# EAGLE design CAN_controller_rear_lighting (EAGLE 9.6.2)
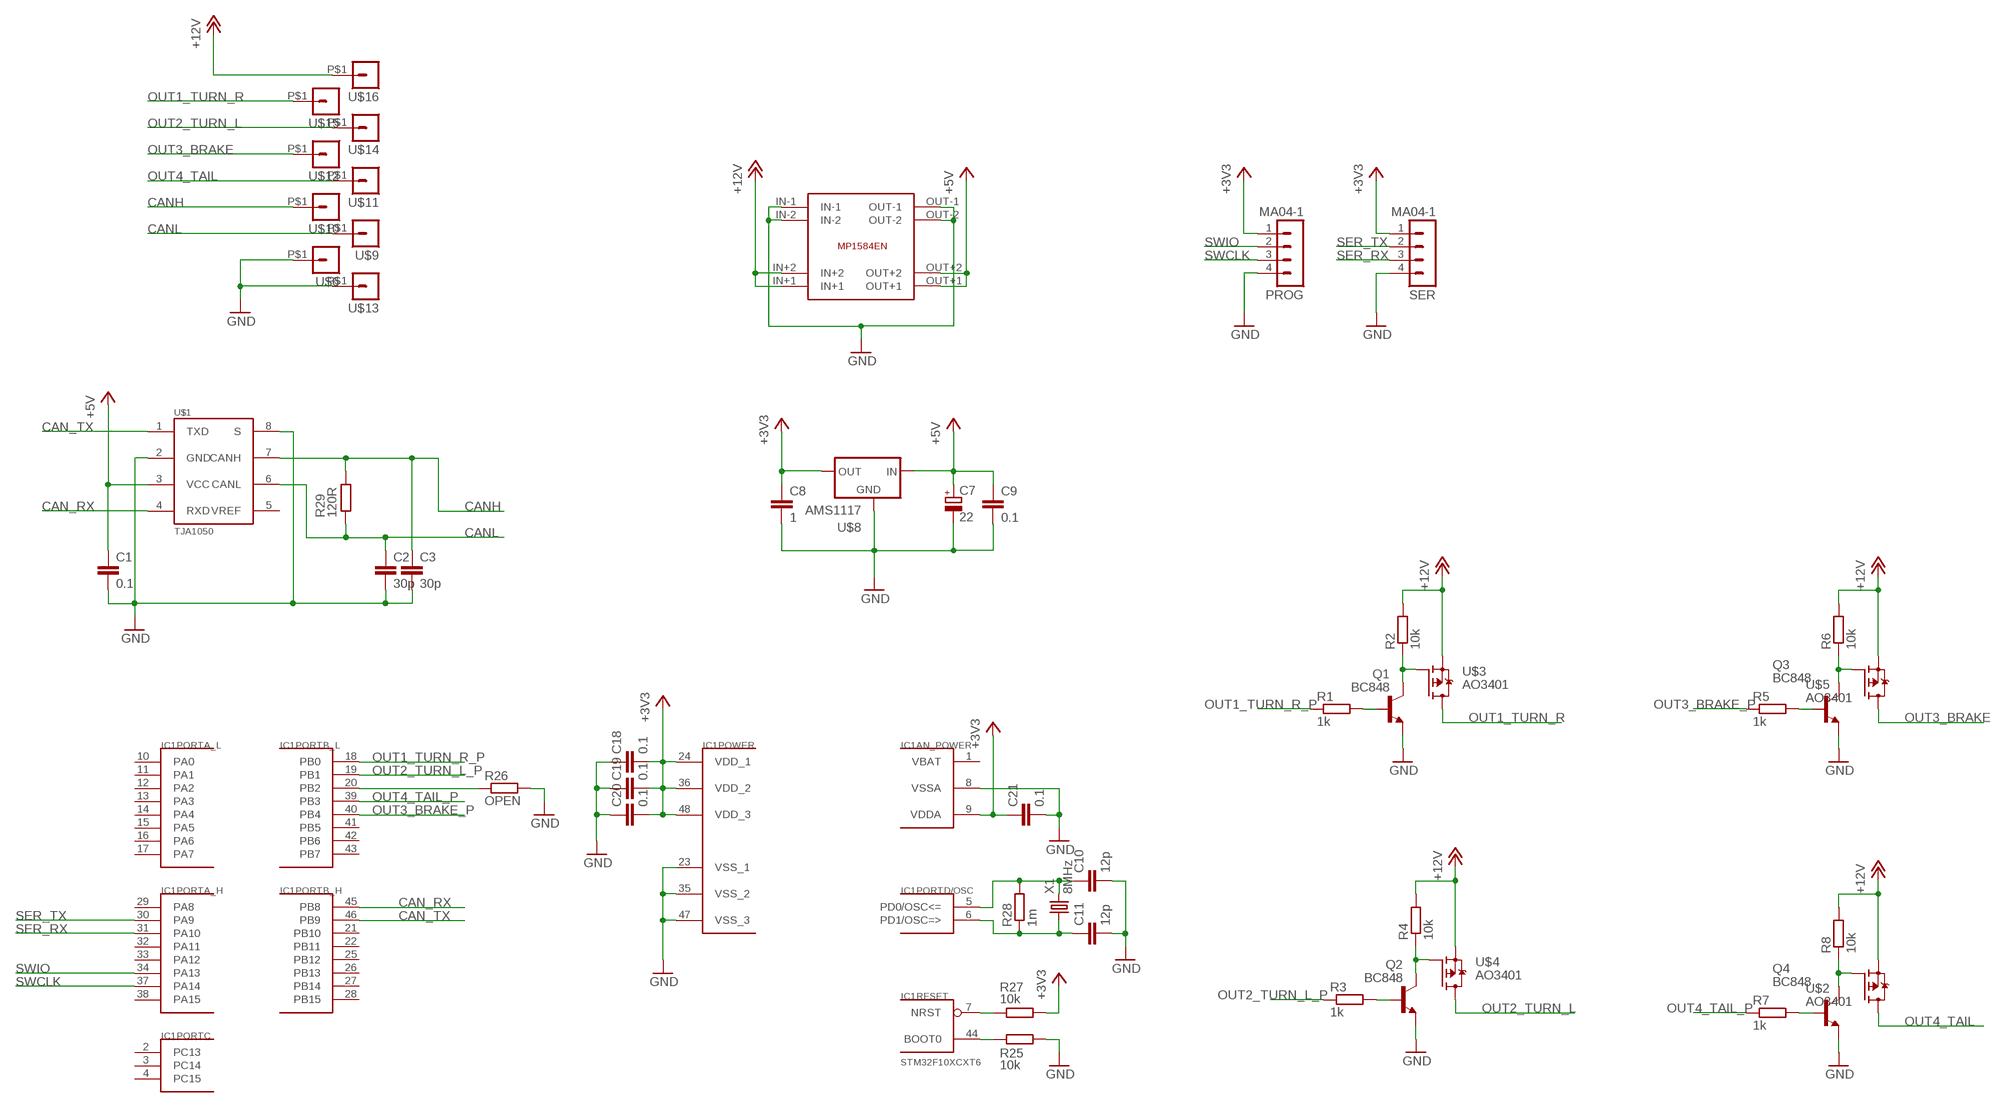
[diagram p0: schematic, sheet 1]

## Parts
C1  0.1  C-EUC0603  [C0603]
C2  30p  C-EUC0603  [C0603]
C3  30p  C-EUC0603  [C0603]
C7  22  CPOL-EUA/3216-18R  [A/3216-18R]
C8  1  C-EUC0805  [C0805]
C9  0.1  C-EUC0603  [C0603]
C10  12p  C-EUC0603  [C0603]
C11  12p  C-EUC0603  [C0603]
C18  0.1  C-EUC0603  [C0603]
C19  0.1  C-EUC0603  [C0603]
C20  0.1  C-EUC0603  [C0603]
C21  0.1  C-EUC0603  [C0603]
IC1  STM32F10XCXT6  [TQFP48]
PROG  MA04-1  [1X04]
Q1  BC848  BC848ALT1SMD  [SOT23]
Q2  BC848  BC848ALT1SMD  [SOT23]
Q3  BC848  BC848ALT1SMD  [SOT23]
Q4  BC848  BC848ALT1SMD  [SOT23]
R1  1k  R-EU_R0603  [R0603]
R2  10k  R-EU_R0603  [R0603]
R3  1k  R-EU_R0603  [R0603]
R4  10k  R-EU_R0603  [R0603]
R5  1k  R-EU_R0603  [R0603]
R6  10k  R-EU_R0603  [R0603]
R7  1k  R-EU_R0603  [R0603]
R8  10k  R-EU_R0603  [R0603]
R25  10k  R-EU_R0603  [R0603]
R26  OPEN  R-EU_R0603  [R0603]
R27  10k  R-EU_R0603  [R0603]
R28  1m  R-EU_R0603  [R0603]
R29  120R  R-EU_R0603  [R0603]
SER  MA04-1  [1X04]
U$1  TJA1050  [SO08]
U$2  AO3401  [SOT23]
U$3  AO3401  [SOT23]
U$4  AO3401  [SOT23]
U$5  AO3401  [SOT23]
U$6  MA01-1WIRE_PAD_1.5MM  [WIRE_PAD_1.5MM]
U$7  MP1584_DC-DC_MODULEMINI_22X17  [MP1584_DC-DC_MODULE]
U$8  AMS1117  [SOT223-W]
U$9  MA01-1WIRE_PAD_1.5MM  [WIRE_PAD_1.5MM]
U$10  MA01-1WIRE_PAD_1.5MM  [WIRE_PAD_1.5MM]
U$11  MA01-1WIRE_PAD_1.5MM  [WIRE_PAD_1.5MM]
U$12  MA01-1WIRE_PAD_1.5MM  [WIRE_PAD_1.5MM]
U$13  MA01-1WIRE_PAD_1.5MM  [WIRE_PAD_1.5MM]
U$14  MA01-1WIRE_PAD_1.5MM  [WIRE_PAD_1.5MM]
U$15  MA01-1WIRE_PAD_1.5MM  [WIRE_PAD_1.5MM]
U$16  MA01-1WIRE_PAD_1.5MM  [WIRE_PAD_1.5MM]
X1  8MHz  CRYSTAL  [XTAL-ECX-53]

## Nets
+3V3: C8.1 C18.2 C19.2 C20.2 C21.1 IC1.9(AN_POWER:VDDA) IC1.24(POWER:VDD_1) IC1.36(POWER:VDD_2) IC1.48(POWER:VDD_3) PROG.1 R27.2 SER.1 U$8.2(OUT)
+5V: C1.1 C7.+ C9.1 U$1.3(VCC) U$7.OUT+1 U$7.OUT+2 U$8.3(IN)
+12V: R2.2 R4.2 R6.2 R8.2 U$2.2(S) U$3.2(S) U$4.2(S) U$5.2(S) U$7.IN+1 U$7.IN+2 U$16.P$1
CAN_RX: IC1.45(PORTB_H:PB8) U$1.4(RXD)
CAN_TX: IC1.46(PORTB_H:PB9) U$1.1(TXD)
CANH: C3.1 R29.2 U$1.7(CANH) U$10.P$1
CANL: C2.1 R29.1 U$1.6(CANL) U$9.P$1
GND: C1.2 C2.2 C3.2 C7.- C8.2 C9.2 C10.2 C11.2 C18.1 C19.1 C20.1 C21.2 IC1.8(AN_POWER:VSSA) IC1.23(POWER:VSS_1) IC1.35(POWER:VSS_2) IC1.47(POWER:VSS_3) PROG.4 Q1.2(E) Q2.2(E) Q3.2(E) Q4.2(E) R25.2 R26.2 SER.4 U$1.2(GND) U$1.8(S) U$6.P$1 U$7.IN-1 U$7.IN-2 U$7.OUT-1 U$7.OUT-2 U$8.1(GND) U$13.P$1
N$1: Q2.1(B) R3.2
N$2: Q2.3(C) R4.1 U$4.1(G)
N$5: Q3.1(B) R5.2
N$6: Q1.1(B) R1.2
N$7: Q1.3(C) R2.1 U$3.1(G)
N$8: Q3.3(C) R6.1 U$5.1(G)
N$9: Q4.1(B) R7.2
N$10: Q4.3(C) R8.1 U$2.1(G)
N$11: C10.1 IC1.5(PORTD/OSC:PD0/OSC<=) R28.2 X1.2
N$12: C11.1 IC1.6(PORTD/OSC:PD1/OSC=>) R28.1 X1.1
N$14: IC1.44(RESET:BOOT0) R25.1
N$16: IC1.20(PORTB_L:PB2) R26.1
N$18: IC1.7(RESET:NRST) R27.1
OUT1_TURN_R: U$3.3(D) U$15.P$1
OUT1_TURN_R_P: IC1.18(PORTB_L:PB0) R1.1
OUT2_TURN_L: U$4.3(D) U$14.P$1
OUT2_TURN_L_P: IC1.19(PORTB_L:PB1) R3.1
OUT3_BRAKE: U$5.3(D) U$12.P$1
OUT3_BRAKE_P: IC1.40(PORTB_L:PB4) R5.1
OUT4_TAIL: U$2.3(D) U$11.P$1
OUT4_TAIL_P: IC1.39(PORTB_L:PB3) R7.1
SER_RX: IC1.31(PORTA_H:PA10) SER.3
SER_TX: IC1.30(PORTA_H:PA9) SER.2
SWCLK: IC1.37(PORTA_H:PA14) PROG.3
SWIO: IC1.34(PORTA_H:PA13) PROG.2
Unconnected: IC1.2(PORTC:PC13) IC1.3(PORTC:PC14) IC1.4(PORTC:PC15) IC1.10(PORTA_L:PA0) IC1.11(PORTA_L:PA1) IC1.12(PORTA_L:PA2) IC1.13(PORTA_L:PA3) IC1.14(PORTA_L:PA4) IC1.15(PORTA_L:PA5) IC1.16(PORTA_L:PA6) IC1.17(PORTA_L:PA7) IC1.21(PORTB_H:PB10) IC1.22(PORTB_H:PB11) IC1.25(PORTB_H:PB12) IC1.26(PORTB_H:PB13) IC1.27(PORTB_H:PB14) IC1.28(PORTB_H:PB15) IC1.29(PORTA_H:PA8) IC1.32(PORTA_H:PA11) IC1.33(PORTA_H:PA12) IC1.38(PORTA_H:PA15) IC1.41(PORTB_L:PB5) IC1.42(PORTB_L:PB6) IC1.43(PORTB_L:PB7) U$1.5(VREF)

## Power pins joined to a net without a drawn wire
VBAT: IC1.1(AN_POWER:VBAT)

## Library data of the parts
C1-C3 C8-C11 C18-C21 = rcl:C-EU: CAPACITOR, European symbol; SPICEPREFIX: C
C7 = rcl:CPOL-EU: POLARIZED CAPACITOR, European symbol; SPICEPREFIX: C
IC1 = stm32:STM32F10XCXT6: ST STM32F101/103 48pin LQFP
PROG SER = motorcycle_projects:MA04-1
Q1-Q4 = common_components:BC848*: NPN Transistor
R1-R8 R25-R29 = resistor:R-EU_: RESISTOR, European symbol
U$1 = motorcycle_projects_copy:TJA1050
U$2-U$5 = common_components:AO3401: 30V 4A P-Channel MOSFET Datasheet: http://www.aosmd.com/pdfs/datasheet/AO3401.pdf
U$6 U$9-U$16 = common_components:MA01-1
U$7 = common_components:MP1584_DC-DC_MODULE
U$8 = motorcycle_projects_copy:AMS1117
X1 = common_components:CRYSTAL: CRYSTAL

## Board
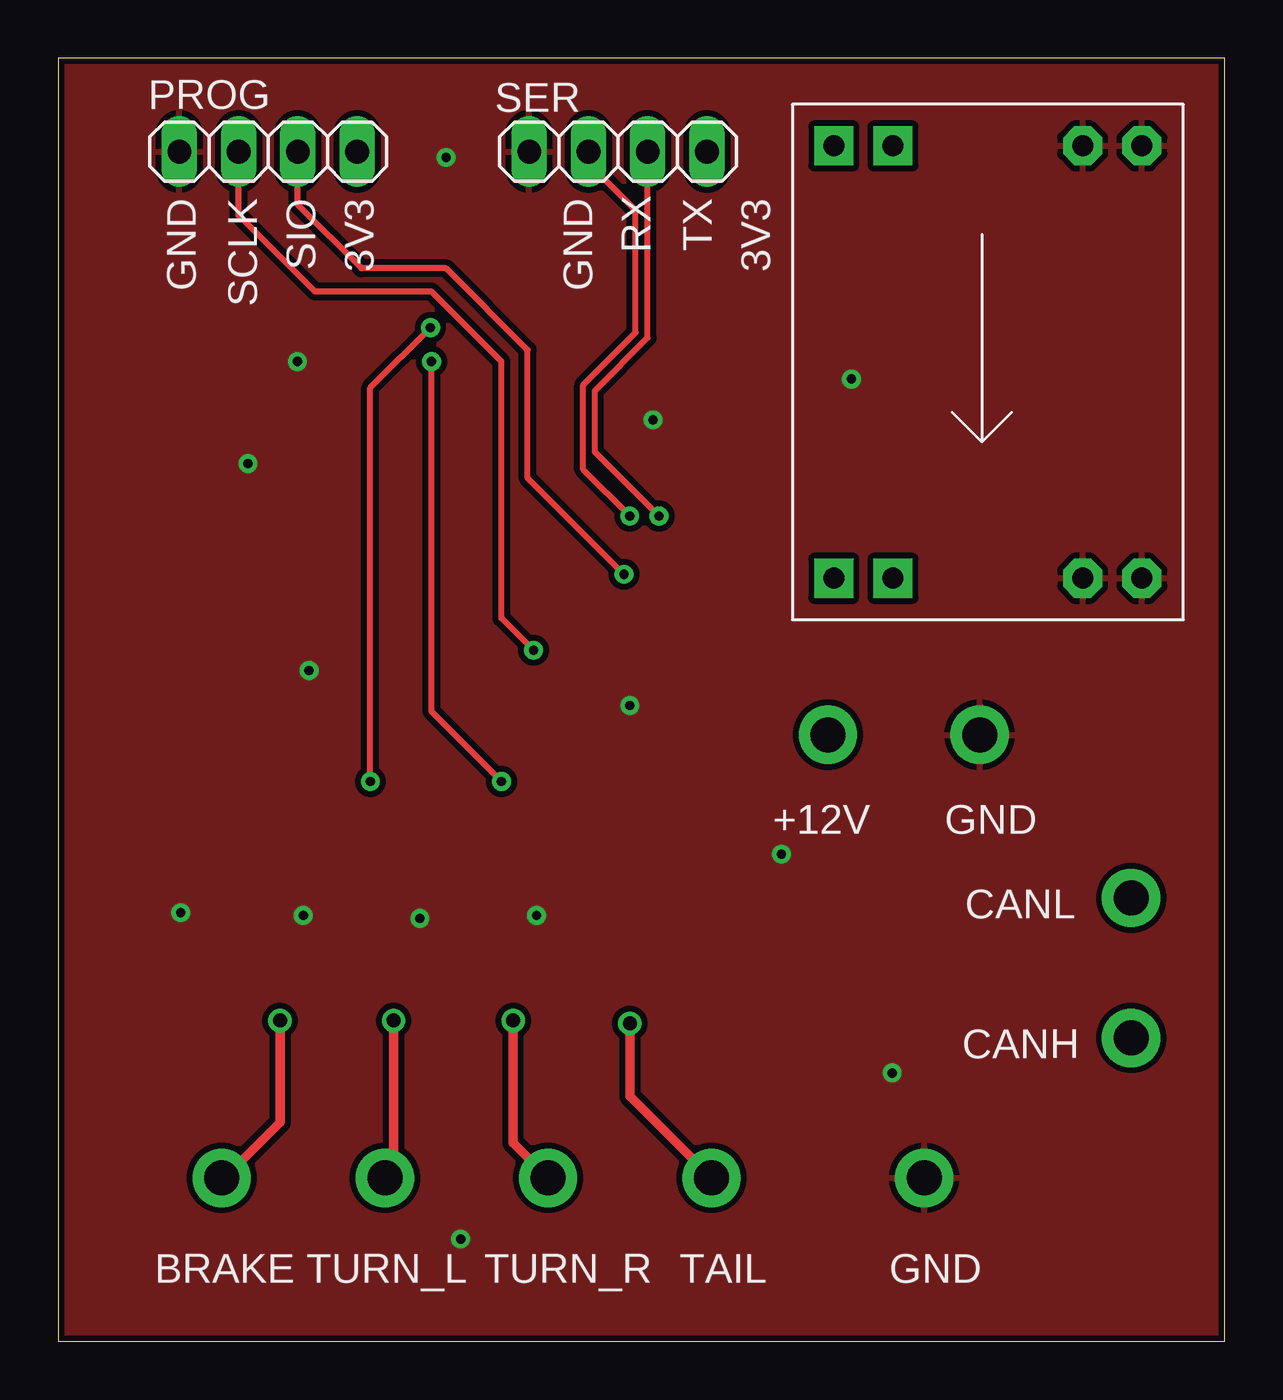
[diagram p1: board, top side]
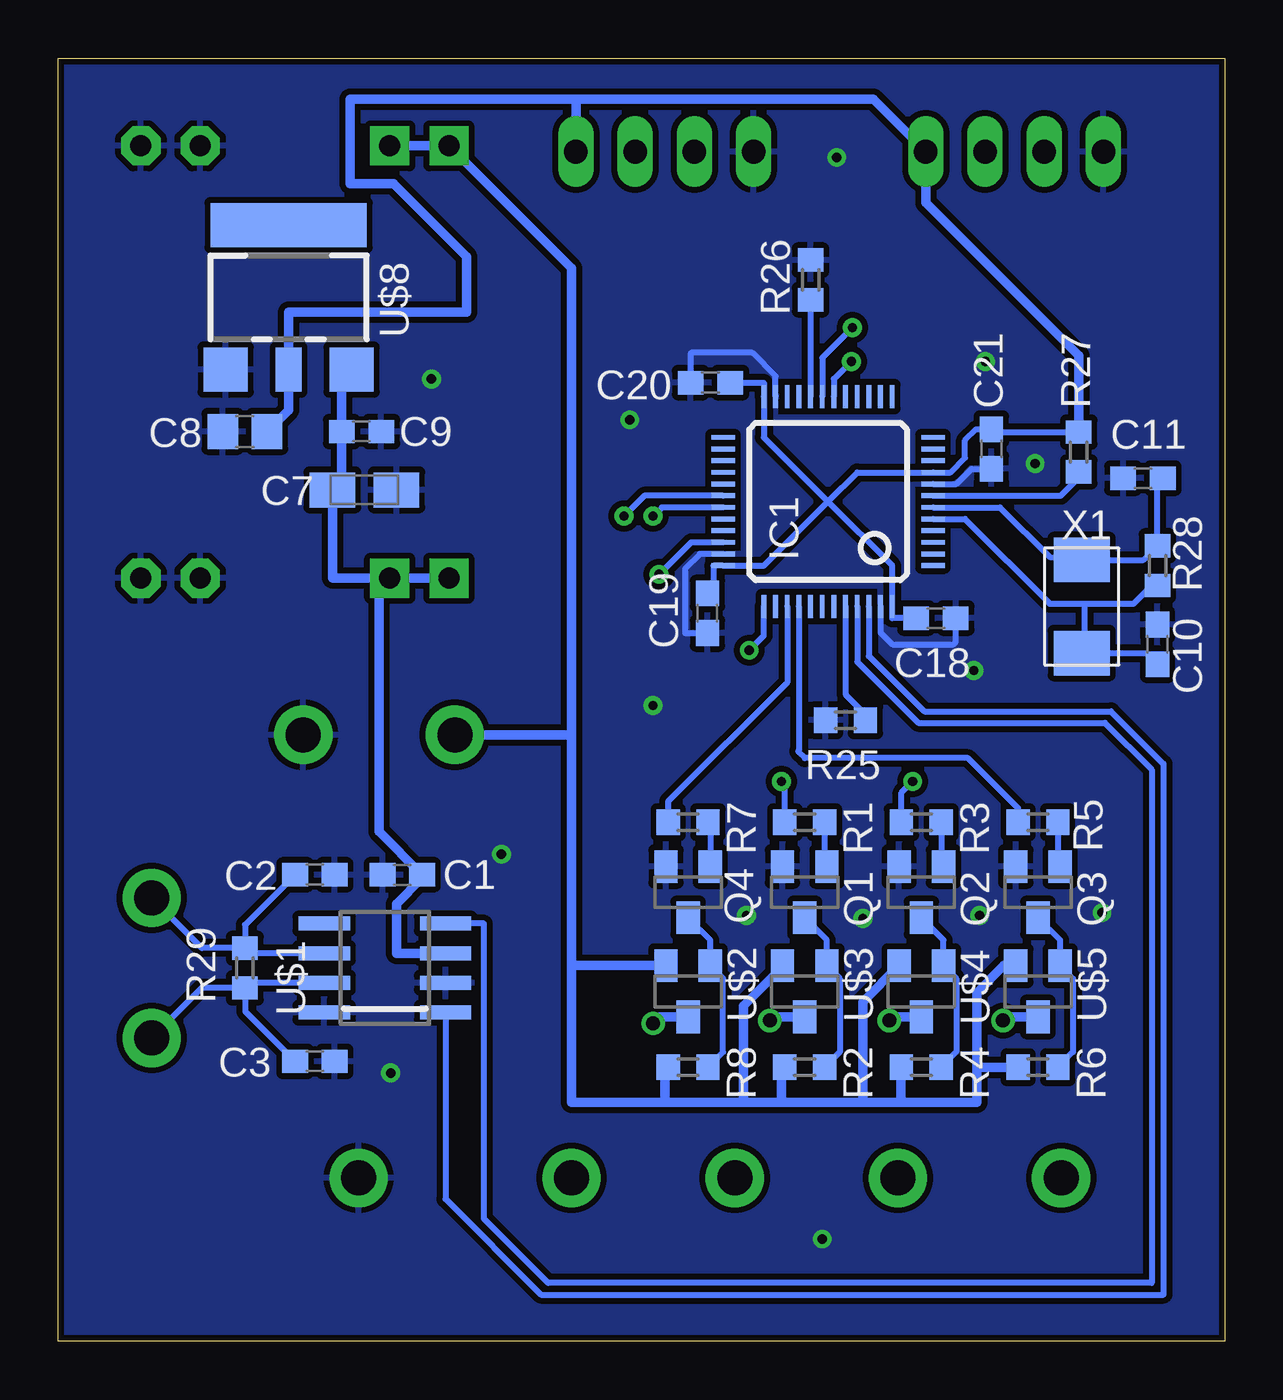
[diagram p2: board, bottom side, seen from below]

Size 50 x 55 mm. Coordinates in mm from the lower left corner, seen from the top.
Outline: 0,0 50,0 50,55 0,55 0,0
Copper layers (1*16): Top 0.035mm / dielectric 1.5mm / Bottom 0.035mm
Design rules "default *": minimum track width 0.2mm, minimum drill 0.35mm, track to track 0.24mm, track to pad 0.24mm, pad to pad 0.24mm, via to via 0.24mm, smd to smd 0.24mm, copper to edge 0.25mm, drill to drill 6mil, minimum pad ring 10mil, minimum via ring 8mil, stop-mask expansion 4mil, vias tented up to drill 0mil, thermal gap 10mil

### Footprints (pad centres in the part's own frame; a part is rotated, then mirrored left to right if it is on the bottom)
C0603 = smd 1.1 x 1: 1 -0.85,0; 2 0.85,0
A/3216-18R = smd 1.95 x 1.5: + 1.375,0; - -1.375,0
C0805 = smd 1.3 x 1.5: 1 -0.95,0; 2 0.95,0
TQFP48 = smd 0.2 x 1: 1 -2.75,-4.5; 2 -2.25,-4.5; 3 -1.75,-4.5; 4 -1.25,-4.5; 5 -0.75,-4.5; 6 -0.25,-4.5; 7 0.25,-4.5; 8 0.75,-4.5; 9 1.25,-4.5; 10 1.75,-4.5; 11 2.25,-4.5; 12 2.75,-4.5; 25 2.75,4.5; 26 2.25,4.5; 27 1.75,4.5; 28 1.25,4.5; 29 0.75,4.5; 30 0.25,4.5; 31 -0.25,4.5; 32 -0.75,4.5; 33 -1.25,4.5; 34 -1.75,4.5; 35 -2.25,4.5; 36 -2.75,4.5 | smd 1 x 0.2: 13 4.5,-2.75; 14 4.5,-2.25; 15 4.5,-1.75; 16 4.5,-1.25; 17 4.5,-0.75; 18 4.5,-0.25; 19 4.5,0.25; 20 4.5,0.75; 21 4.5,1.25; 22 4.5,1.75; 23 4.5,2.25; 24 4.5,2.75; 37 -4.5,2.75; 38 -4.5,2.25; 39 -4.5,1.75; 40 -4.5,1.25; 41 -4.5,0.75; 42 -4.5,0.25; 43 -4.5,-0.25; 44 -4.5,-0.75; 45 -4.5,-1.25; 46 -4.5,-1.75; 47 -4.5,-2.25; 48 -4.5,-2.75
1X04 = drill 1.016 long: 1 -3.81,0; 2 -1.27,0; 3 1.27,0; 4 3.81,0
SOT23 = smd 1 x 1.4: 1 -0.95,-1.1; 2 0.95,-1.1; 3 0,1.1
R0603 = smd 1 x 1.1: 1 -0.85,0; 2 0.85,0
SO08 = smd 0.6 x 2.2: 1 -1.905,-2.6; 2 -0.635,-2.6; 3 0.635,-2.6; 4 1.905,-2.6; 5 1.905,2.6; 6 0.635,2.6; 7 -0.635,2.6; 8 -1.905,2.6
WIRE_PAD_1.5MM = drill 1.5 pad 2.5: P$1 0,0
MP1584_DC-DC_MODULE = drill 0.9 pad 1.676 square: IN+1 0,0; IN+2 0,2.54; OUT+1 18.542,0; OUT+2 18.542,2.54 | drill 0.9 pad 1.676 octagon: IN-1 0,13.208; IN-2 0,10.668; OUT-1 18.542,13.208; OUT-2 18.542,10.668
SOT223-W = smd 1.9 x 1.9: 1 -2.7,-3.1; 3 2.7,-3.1 | smd 1.1 x 1.9: 2 0,-3.1 | smd 6.7 x 1.9: 4 0,3.1
XTAL-ECX-53 = smd 1.9 x 2.4: 1 -2,0; 2 2,0

### Placement (x,y rotation side)
C1  35.25,20 180 bottom
C2  39,20 0 bottom
C3  39,12 0 bottom
C7  36.88,36.5 180 bottom
C8  42,39 180 bottom
C9  37,39 0 bottom
C10  2.88,29.88 90 bottom
C11  3.5,37 180 bottom
C18  12.38,31 180 bottom
C19  22.17,31.21 90 bottom
C20  22.04,41.09 0 bottom
C21  10,38.25 270 bottom
IC1  17,36 90 bottom
PROG  9,51 180 top
Q1  18,19.25 180 bottom
Q2  13,19.25 180 bottom
Q3  8,19.25 180 bottom
Q4  23,19.25 180 bottom
R1  18,22.25 0 bottom
R2  18,11.75 180 bottom
R3  13,22.25 0 bottom
R4  13,11.75 180 bottom
R5  8,22.25 0 bottom
R6  8,11.75 180 bottom
R7  23,22.25 0 bottom
R8  23,11.75 180 bottom
R25  16.25,26.62 180 bottom
R26  17.75,45.5 90 bottom
R27  6.25,38.12 90 bottom
R28  2.88,33.25 270 bottom
R29  42,16 270 bottom
SER  24,51 180 top
U$1  36,16 90 bottom
U$2  23,15 180 bottom
U$3  18,15 180 bottom
U$4  13,15 180 bottom
U$5  8,15 180 bottom
U$6  39.5,26 0 top
U$7  33.25,51.25 270 top
U$8  40.12,44.75 0 bottom
U$9  46,19 0 top
U$10  46,13 0 top
U$11  28,7 0 bottom
U$12  7,7 0 top
U$13  37.12,7 0 top
U$14  14,7 0 top
U$15  21,7 0 top
U$16  33,26 0 top
X1  6.12,31.5 270 bottom

### Tracks (layer width: path | path; a pad name or v marks a point on that pad's centre or on a via)
+3V3
  Bottom 0.254: C20.2 19.75,41.09 IC1.24 19.75,38.75 17,36 | C19.2 21.92,32.31 21.92,33.25 IC1.36 19.75,33.25 17,36 | C18.2 14.25,31 IC1.48 14.25,33.25 17,36 | 17,36 15.75,37.25 IC1.9 11.75,37.25 11.12,37.88 11.12,38.62 10.65,39.1 C21.1 9.88,38.98 R27.2
  Bottom 0.406: C8.1 40.12,39.92 U$8.2 40.12,44.12 32.5,44.12 32.5,46.5 35.62,49.62 37.5,49.62 37.5,53.25 27.81,53.25 | 27.81,53.25 15.06,53.25 PROG.1 12.81,48.81 6.25,42.25 R27.2 | SER.1 27.81,53.25
+5V
  Bottom 0.406: U$8.3 37.85,41.23 C9.1 37.85,36.9 C7.+ 38.25,32.71 36,32.71 | U$7.OUT+1 U$7.OUT+2 36,32.71 | U$1.3 35.5,16.64 35.5,18.75 34.4,19.85 C1.1 36.25,21.85 36.25,32.46 36,32.71
+12V
  Bottom 0.406: U$3.2 18.95,16.05 20.62,14.38 20.62,10.25 | 20.62,10.25 24,10.25 | 24,10.25 28,10.25 28,16 | U$5.2 9.45,16.1 10.62,14.93 10.62,11.75 | 10.62,11.75 10.62,10.25 13.88,10.25 | 13.88,10.25 13.88,11.72 R4.2 | U$4.2 15.5,14.55 15.5,10.25 | 15.5,10.25 19,10.25 | 19,10.25 19,11.75 R2.2 | 13.88,10.25 15.5,10.25 | 19,10.25 20.62,10.25 | 28,16 28,26 | 28,26 28,46 U$7.IN+1 U$7.IN+2 | R6.2 10.62,11.75 | U$2.2 27.9,16.1 28,16 | U$16.P$1 28,26 | R8.2 24,11.75 24,10.25
CAN_RX
  Bottom 0.254: IC1.45 15.75,29.12 13.13,26.51 5.12,26.51 3.12,24.51 3.12,2.5 29,2.5 31.75,5.25 31.75,17.91 U$1.4
CAN_TX
  Bottom 0.254: U$1.1 33.4,6.09 29.3,2 2.62,2 2.62,24.75 4.88,27 12.88,27 15.25,29.38 IC1.46
CANH
  Bottom 0.254: 41.98,15.12 41.92,15.07 41.63,15.37 U$1.7 | 41.98,15.12 R29.2 43.85,15.15 U$10.P$1 | C3.1 41.98,14.12 41.98,15.12
CANL
  Bottom 0.254: U$1.6 41.78,16.64 R29.1 | R29.1 43.85,16.85 U$9.P$1 | C2.1 42,17.85 R29.1
GND  (via drill 0.4)
  Bottom 0.254: IC1.23 19.25,41.38 20.25,42.38 22.86,42.38 22.89,42.34 C20.1 | IC1.35 22.5,33.75 23.12,33.12 23.12,30.36 C19.1 | IC1.47 14.75,30.38 14.25,29.88 11.62,29.88 11.53,29.98 C18.1 | IC1.8 11.5,36.75 10.85,37.4 C21.2
  other vias: 10.75,28.75 8.12,37.62 16.62,50.75 10.5,18.25 15.5,18.12 25.5,39.5 34,41.25 24.5,27.25 17.25,4.38 5.25,18.38 20.5,18.25 35.75,11.5 31,20.88 10.25,42
  pour Bottom (isolate 0.254): 0,0 50,0 50,55 0,55
  pour Top (isolate 0.254): 0,0 50,0 50,55 0,55
N$1
  Bottom 0.254: R3.2 12.15,20.45 Q2.1
N$2
  Bottom 0.254: Q2.3 12.05,17.2 U$4.1 11.5,15.55 11.5,12.4 R4.1
N$5
  Bottom 0.254: R5.2 7.15,20.45 Q3.1
N$6
  Bottom 0.254: R1.2 17.15,20.45 Q1.1
N$7
  Bottom 0.254: Q1.3 17.05,17.2 U$3.1 16.5,15.55 16.5,12.4 R2.1
N$8
  Bottom 0.254: Q3.3 7.05,17.2 U$5.1 6.5,15.55 6.5,12.4 R6.1
N$9
  Bottom 0.254: R7.2 22.05,22.15 Q4.1
N$10
  Bottom 0.254: Q4.3 22.05,17.2 U$2.1 21.5,15.55 21.5,12.4 R8.1
N$11
  Bottom 0.254: IC1.5 11.12,35.25 7.5,31.62 6,31.62 | R28.2 3.12,32.4 3.9,31.62 6,31.62 | C10.1 3.35,29.5 X1.2 6,29.62 6,31.62
N$12
  Bottom 0.254: C11.1 2.88,37 R28.1 3.48,33.5 X1.1 7.5,33.62 9.62,35.75 IC1.6
N$14
  Bottom 0.254: R25.1 15.4,26.88 16.25,27.73 IC1.44
N$16
  Bottom 0.254: R26.1 IC1.20
N$18
  Bottom 0.254: IC1.7 7.03,36.25 6.25,37.02 R27.1
OUT1_TURN_R  (via drill 0.6)
  Top 0.406: U$15.P$1 19.5,8.5 v19.5,13.75
  Bottom 0.254: 19.35,13.9 v19.5,13.75
  Bottom 0.406: U$3.3 19.35,13.9
OUT1_TURN_R_P  (via drill 0.4)
  Top 0.254: v19,24 16,27 v16,42
  Bottom 0.254: R1.1 18.85,23.85 v19,24 | v16,42 16.75,41.25 IC1.18
OUT2_TURN_L  (via drill 0.6)
  Top 0.406: v14.38,13.75 14.38,7.38 U$14.P$1
  Bottom 0.406: U$4.3 14.22,13.9 v14.38,13.75
OUT2_TURN_L_P  (via drill 0.4)
  Top 0.254: v13.38,24 13.38,40.88 v15.96,43.45
  Bottom 0.254: R3.1 13.85,23.52 v13.38,24 | v15.96,43.45 17.25,42.16 IC1.19
OUT3_BRAKE  (via drill 0.6)
  Top 0.254: 7.12,7 U$12.P$1
  Top 0.406: v9.5,13.75 9.5,9.38 7.12,7
  Bottom 0.406: U$5.3 9.35,13.9 v9.5,13.75
OUT3_BRAKE_P
  Bottom 0.254: R5.1 8.85,22.85 11,25 18,25 18.28,25.28 18.25,25.32 IC1.40
OUT4_TAIL  (via drill 0.6)
  Top 0.406: v24.5,13.62 24.5,10.5 U$11.P$1
  Bottom 0.406: U$2.3 24.23,13.9 v24.5,13.62
OUT4_TAIL_P
  Bottom 0.254: IC1.39 18.75,28.25 23.85,23.15 R7.1
SER_RX  (via drill 0.4)
  Top 0.254: v24.5,35.38 22.5,37.38 22.5,41 24.75,43.25 24.75,48.48 22.73,50.5 SER.3
  Bottom 0.254: IC1.31 24.12,35.75 v24.5,35.38
SER_TX  (via drill 0.4)
  Top 0.254: v25.75,35.38 23,38.12 23,40.75 25.27,43.02 SER.2
  Bottom 0.254: IC1.30 24.88,36.25 v25.75,35.38
SWCLK  (via drill 0.4)
  Top 0.254: v20.38,29.62 19,31 19,42 16,45 11,45 7.73,48.27 PROG.3
  Bottom 0.254: v20.38,29.62 19.75,30.25 IC1.37
SWIO  (via drill 0.4)
  Top 0.254: v24.25,32.88 20.12,37 20.12,42.5 16.62,46 13,46 10.27,48.73 PROG.2
  Bottom 0.254: IC1.34 22.88,34.25 v24.25,32.88

### Text on the board
tNames: GND | SCLK | SIO | 3V3 | GND | RX | TX | 3V3 | +12V | GND | CANL | CANH | BRAKE | TURN_L | TURN_R | TAIL | GND